# Altium schematic sheet Sensors.SchDoc
size A4; Organization: Altium Limited; Address1: L3, 12a Rodborough Rd; Address2: Frenchs Forest; Address3: NSW; Address4: Australia 2086; SheetNumber: 2; SheetTotal: 7
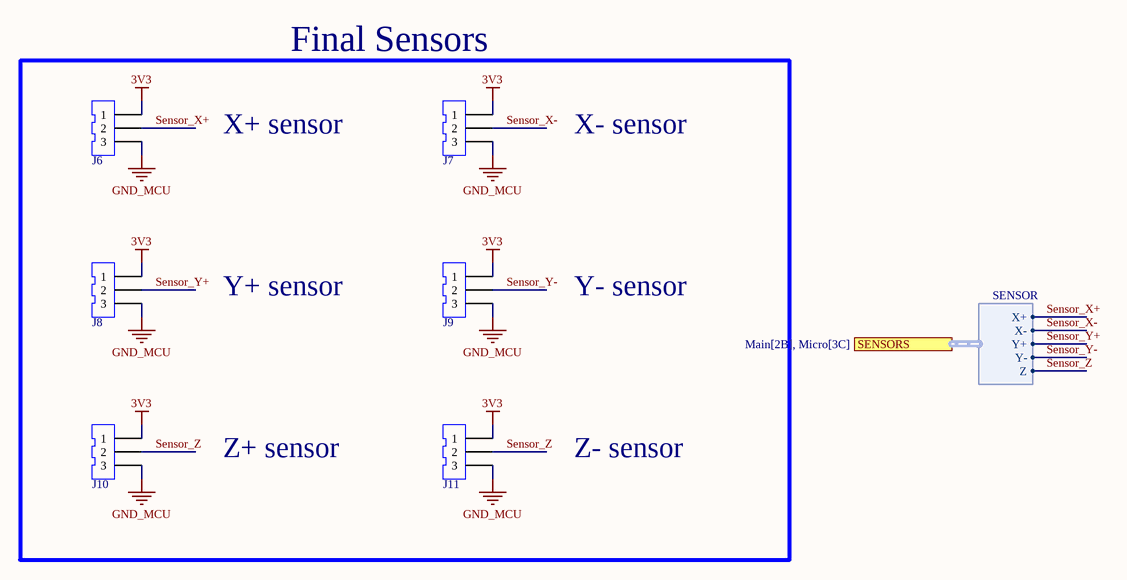
[diagram p0: Sensors.SchDoc]

## Parts
J6  CONN HEADER TH 3POS 2.5mm  [JST_B3B-XH-A]  (value not drawn)
J7  CONN HEADER TH 3POS 2.5mm  [JST_B3B-XH-A]  (value not drawn)
J8  CONN HEADER TH 3POS 2.5mm  [JST_B3B-XH-A]  (value not drawn)
J9  CONN HEADER TH 3POS 2.5mm  [JST_B3B-XH-A]  (value not drawn)
J10  CONN HEADER TH 3POS 2.5mm  [JST_B3B-XH-A]  (value not drawn)
J11  CONN HEADER TH 3POS 2.5mm  [JST_B3B-XH-A]  (value not drawn)

## Ports
SENSORS (harness SENSOR, see Main[2B], Micro[3C])

## Harnesses
SENSOR: X-, Y+, Y-, X+, Z

## Nets
3V3: J6.1 J7.1 J8.1 J9.1 J10.1 J11.1
GND_MCU: J6.3 J7.3 J8.3 J9.3 J10.3 J11.3
Sensor_X+: J6.2 ; port SENSORS.X+
Sensor_X-: J7.2 ; port SENSORS.X-
Sensor_Y+: J8.2 ; port SENSORS.Y+
Sensor_Y-: J9.2 ; port SENSORS.Y-
Sensor_Z: J10.2 J11.2 ; port SENSORS.Z

## Notes on the sheet
- Final Sensors
- X+ sensor
- X- sensor
- Y+ sensor
- Y- sensor
- Z+ sensor
- Z- sensor
- Title
- Size:
- Date:
- A4
- Number:
- Time:
- Revision:
- Sheet
- of
- File:

## Library data of the parts
J6-J11 = Connector JST 3pin: 3P 1x3P XH Tin -25℃~+85℃ White 2.5mm 250V 3 3A 1 Through Hole Through Hole,P=2.5mm Headers, Male Pins RoHS; Manufacturer: JST; Manufacturer Part Number: B3B-XH-A(LF)(SN); Supplier 1: LCSC; Supplier Part Number 1: C144394; ComponentLink1Description: LCSC; ComponentLink1URL: https://www.lcsc.com/product-detail/C144394.html?s_z=n_JST%2520b3